# EAGLE design M121 (EAGLE 6.6.0)
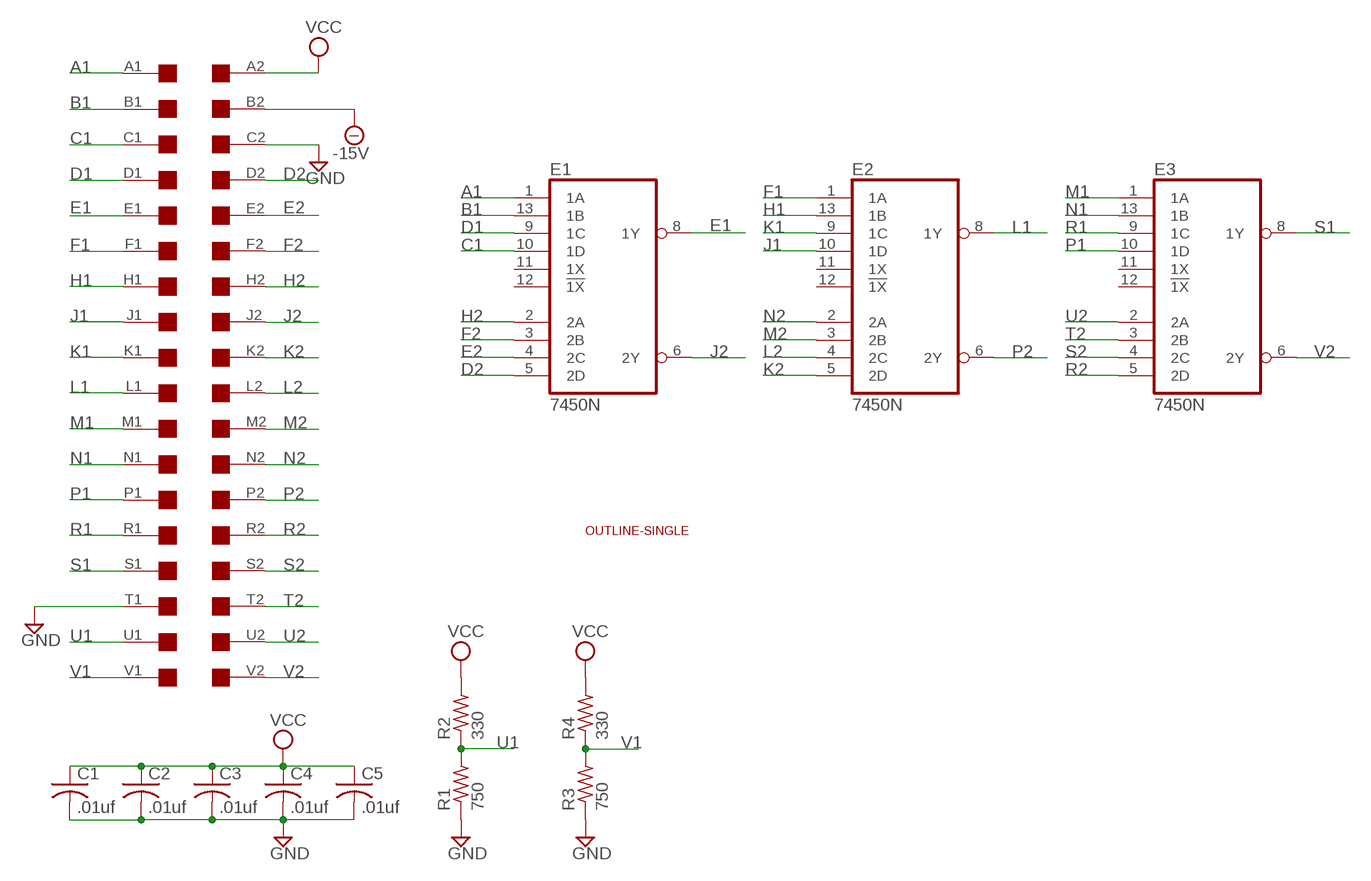
[diagram p0: schematic, sheet 1]

## Parts
C1  .01uf  C-US050-025X075  [C050-025X075]
C2  .01uf  C-US050-025X075  [C050-025X075]
C3  .01uf  C-US050-025X075  [C050-025X075]
C4  .01uf  C-US050-025X075  [C050-025X075]
C5  .01uf  C-US050-025X075  [C050-025X075]
E1  7450N  [DIL14]
E2  7450N  [DIL14]
E3  7450N  [DIL14]
R1  750  R-US_0207/10  [0207/10]
R2  330  R-US_0207/10  [0207/10]
R3  750  R-US_0207/10  [0207/10]
R4  330  R-US_0207/10  [0207/10]
U$1  OUTLINE-SINGLE  [SINGLE]
U$4  SINGLE  [EDGE-CON2]

## Nets
-15V: U$4.B2
A1: E1.1(1A) U$4.A1
B1: E1.13(1B) U$4.B1
C1: E1.10(1D) U$4.C1
D1: E1.9(1C) U$4.D1
D2: E1.5(2D) U$4.D2
E1: E1.8(1Y) U$4.E1
E2: E1.4(2C) U$4.E2
F1: E2.1(1A) U$4.F1
F2: E1.3(2B) U$4.F2
GND: C1.2 C2.2 C3.2 C4.2 C5.2 R1.1 R3.1 U$4.C2 U$4.T1
H1: E2.13(1B) U$4.H1
H2: E1.2(2A) U$4.H2
J1: E2.10(1D) U$4.J1
J2: E1.6(2Y) U$4.J2
K1: E2.9(1C) U$4.K1
K2: E2.5(2D) U$4.K2
L1: E2.8(1Y) U$4.L1
L2: E2.4(2C) U$4.L2
M1: E3.1(1A) U$4.M1
M2: E2.3(2B) U$4.M2
N1: E3.13(1B) U$4.N1
N2: E2.2(2A) U$4.N2
P1: E3.10(1D) U$4.P1
P2: E2.6(2Y) U$4.P2
R1: E3.9(1C) U$4.R1
R2: E3.5(2D) U$4.R2
S1: E3.8(1Y) U$4.S1
S2: E3.4(2C) U$4.S2
T2: E3.3(2B) U$4.T2
U1: R1.2 R2.1 U$4.U1
U2: E3.2(2A) U$4.U2
V1: R3.2 R4.1 U$4.V1
V2: E3.6(2Y) U$4.V2
VCC: C1.1 C2.1 C3.1 C4.1 C5.1 R2.2 R4.2 U$4.A2
Unconnected: E1.11(1X) E1.12(!1X) E2.11(1X) E2.12(!1X) E3.11(1X) E3.12(!1X)

## Power pins joined to a net without a drawn wire
GND: E1.7(GND) E2.7(GND) E3.7(GND)
VCC: E1.14(VCC) E2.14(VCC) E3.14(VCC)

## Library data of the parts
C1-C5 = rcl:C-US: CAPACITOR, American symbol
E1-E3 = dec-con:74*50: Dual 2-wide 2-input AND OR INVERTER gate (one gate expandable)
R1-R4 = rcl:R-US_: RESISTOR, American symbol
U$1 = dec-con:OUTLINE-*: Board outlines for DEC boards.
U$4 = dec-con:SINGLE: Single-Height DEC board

## Board
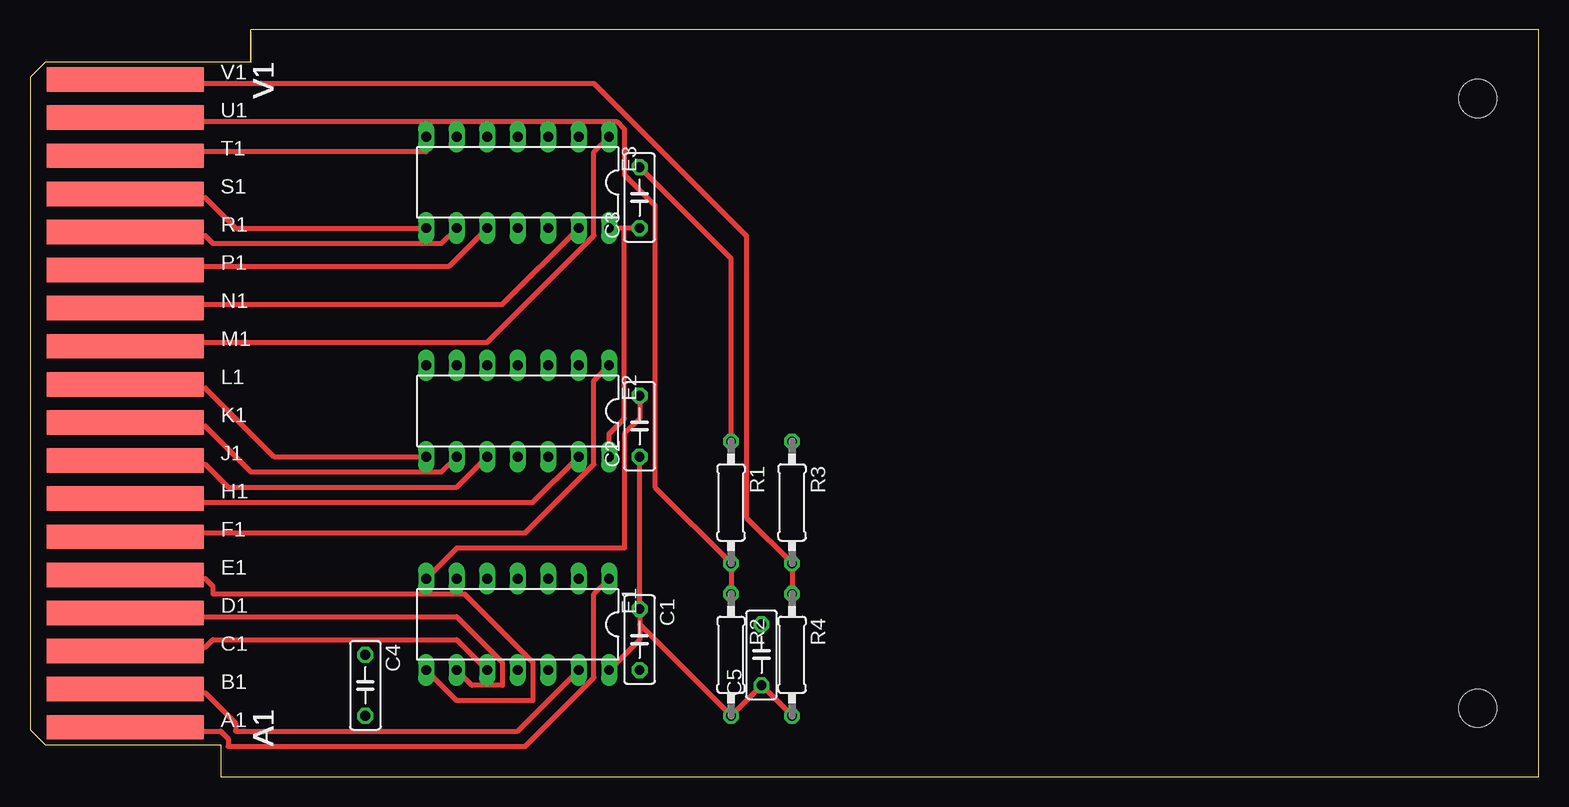
[diagram p1: board, top side]
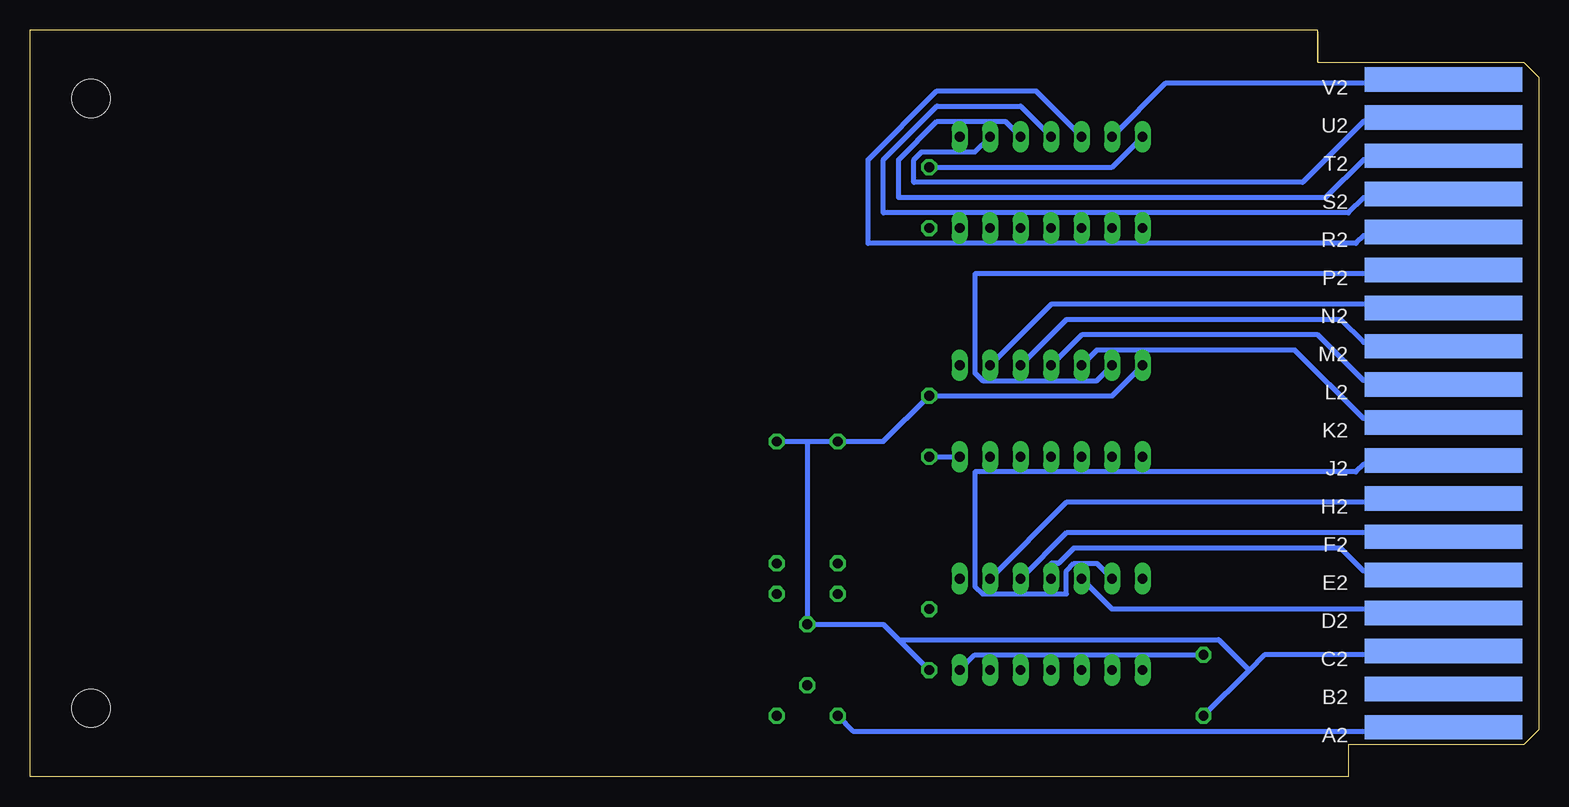
[diagram p2: board, bottom side, seen from below]

Size 125.73 x 62.23 mm. Coordinates in mm from the lower left corner, seen from the top.
Copper layers (1+16): Top 0.035mm / dielectric 1.5mm / Bottom 0.035mm
Design rules "16mils": minimum track width 16mil, minimum drill 32mil, track to track 15mil, track to pad 10mil, pad to pad 10mil, via to via 10mil, smd to smd 10mil, copper to edge 13mil, drill to drill 10mil, minimum pad ring 10mil, minimum via ring 8mil, stop-mask expansion 0mil, vias tented up to drill 0mil, thermal gap 10mil

### Footprints (pad centres in the part's own frame; a part is rotated, then mirrored left to right if it is on the bottom)
C050-025X075 = drill 0.813 octagon: 1 -2.54,0; 2 2.54,0
DIL14 = drill 0.813 long: 1 -7.62,-3.81; 2 -5.08,-3.81; 3 -2.54,-3.81; 4 0,-3.81; 5 2.54,-3.81; 6 5.08,-3.81; 7 7.62,-3.81; 8 7.62,3.81; 9 5.08,3.81; 10 2.54,3.81; 11 0,3.81; 12 -2.54,3.81; 13 -5.08,3.81; 14 -7.62,3.81
0207/10 = drill 0.813 octagon: 1 -5.08,0; 2 5.08,0
SINGLE = hole 3.175: 120.65,56.515; 120.65,5.715
EDGE-CON2 = smd 13.106 x 2.032: A1 7.938,4.128; B1 7.938,7.303; C1 7.938,10.477; D1 7.938,13.652; E1 7.938,16.828; F1 7.938,20.003; H1 7.938,23.177; J1 7.938,26.352; K1 7.938,29.527; L1 7.938,32.703; M1 7.938,35.877; N1 7.938,39.053; P1 7.938,42.227; R1 7.938,45.403; S1 7.938,48.578; T1 7.938,51.752; U1 7.938,54.928; V1 7.938,58.102 | smd 13.106 x 2.032 bottom: A2 7.938,4.128; B2 7.938,7.303; C2 7.938,10.477; D2 7.938,13.652; E2 7.938,16.828; F2 7.938,20.003; H2 7.938,23.177; J2 7.938,26.352; K2 7.938,29.527; L2 7.938,32.703; M2 7.938,35.877; N2 7.938,39.053; P2 7.938,42.227; R2 7.938,45.403; S2 7.938,48.578; T2 7.938,51.752; U2 7.938,54.928; V2 7.938,58.102

### Placement (x,y rotation side)
C1  50.8,11.43 270 top
C2  50.8,29.21 90 top
C3  50.8,48.26 90 top
C4  27.94,7.62 270 top
C5  60.96,10.16 90 top
E1  40.64,12.7 180 top
E2  40.64,30.48 180 top
E3  40.64,49.53 180 top
R1  58.42,22.86 270 top
R2  58.42,10.16 270 top
R3  63.5,22.86 270 top
R4  63.5,10.16 270 top
U$1  0,0 0 top
U$4  0,0 0 top

### Tracks (layer width: path | path; a pad name or v marks a point on that pad's centre or on a via)
A1
  Top 0.406: E1.1 46.99,15.24 46.99,8.26 41.28,2.54 16.51,2.54 16.51,3.17 15.88,3.81 8.26,3.81 U$4.A1
B1
  Top 0.406: E1.13 40.64,3.81 17.15,3.81 17.15,4.45 14.61,6.99 8.26,6.99 U$4.B1
C1
  Top 0.406: E1.10 35.56,11.43 15.24,11.43 14.61,10.79 8.26,10.79 U$4.C1
D1
  Top 0.406: E1.9 36.83,7.62 39.37,7.62 39.37,9.53 35.56,13.34 8.26,13.34 U$4.D1
D2
  Bottom 0.406: E1.5 35.56,13.97 8.26,13.97 U$4.D2
E1
  Top 0.406: E1.8 35.56,6.35 41.91,6.35 41.91,9.53 36.2,15.24 15.24,15.24 15.24,15.88 14.61,16.51 8.26,16.51 U$4.E1
E2
  Bottom 0.406: E1.4 40.64,17.78 40.01,17.78 38.74,19.05 16.51,19.05 14.61,17.14 8.26,17.14 U$4.E2
F1
  Top 0.406: E2.1 46.99,33.02 46.99,26.04 41.28,20.32 8.26,20.32 U$4.F1
F2
  Bottom 0.406: E1.3 39.37,20.32 8.26,20.32 U$4.F2
GND
  Top 0.406: E1.7 35.56,19.05 49.53,19.05 49.53,28.57 50.8,29.84 C2.2 | C3.2 58.42,43.18 R1.1 | E3.7 33.02,52.07 8.26,52.07 U$4.T1
  Bottom 0.406: 24.13,8.89 22.86,10.16 8.26,10.16 U$4.C2 | 24.13,8.89 C4.2 | E2.7 35.56,31.75 C2.2 54.61,27.94 R1.1 60.96,27.94 | 53.34,11.43 54.61,12.7 C5.2 60.96,27.94 | 53.34,11.43 C1.2 | R3.1 60.96,27.94 | E3.7 35.56,50.8 C3.2 | 24.13,8.89 26.67,11.43 53.34,11.43
H1
  Top 0.406: E2.13 41.91,22.86 8.26,22.86 U$4.H1
H2
  Bottom 0.406: E1.2 39.37,22.86 8.26,22.86 U$4.H2
J1
  Top 0.406: E2.10 35.56,24.13 16.51,24.13 14.61,26.04 8.26,26.04 U$4.J1
J2
  Bottom 0.406: E1.6 36.83,17.78 38.74,17.78 39.37,17.14 39.37,15.24 46.36,15.24 46.99,15.88 46.99,25.4 15.24,25.4 14.61,26.04 8.26,26.04 U$4.J2
K1
  Top 0.406: E2.9 34.29,25.4 18.42,25.4 14.61,29.21 8.26,29.21 U$4.K1
K2
  Bottom 0.406: E2.5 36.83,35.56 20.32,35.56 14.61,29.84 8.26,29.84 U$4.K2
L1
  Top 0.406: E2.8 20.32,26.67 14.61,32.38 8.26,32.38 U$4.L1
L2
  Bottom 0.406: E2.4 38.1,36.83 18.42,36.83 14.61,33.02 8.26,33.02 U$4.L2
M1
  Top 0.406: E3.1 46.99,52.07 46.99,45.09 38.1,36.2 8.26,36.2 U$4.M1
M2
  Bottom 0.406: E2.3 39.37,38.1 16.51,38.1 14.61,36.2 8.26,36.2 U$4.M2
N1
  Top 0.406: E3.13 39.37,39.37 8.26,39.37 U$4.N1
N2
  Bottom 0.406: E2.2 40.64,39.37 8.26,39.37 U$4.N2
P1
  Top 0.406: E3.10 34.93,42.55 8.26,42.55 U$4.P1
P2
  Bottom 0.406: E2.6 36.83,33.02 46.36,33.02 46.99,33.66 46.99,41.91 8.26,41.91 U$4.P2
R1
  Top 0.406: E3.9 34.29,44.45 15.24,44.45 14.61,45.09 8.26,45.09 U$4.R1
R2
  Bottom 0.406: E3.5 41.91,57.15 50.17,57.15 55.88,51.44 55.88,44.45 15.24,44.45 14.61,45.09 8.26,45.09 U$4.R2
S1
  Top 0.406: E3.8 17.15,45.72 14.61,48.26 8.26,48.26 U$4.S1
S2
  Bottom 0.406: E3.4 43.18,55.88 50.17,55.88 54.61,51.44 54.61,46.99 15.88,46.99 14.61,48.26 8.26,48.26 U$4.S2
T2
  Bottom 0.406: E3.3 44.45,54.61 50.17,54.61 53.34,51.44 53.34,48.26 17.78,48.26 14.61,51.44 8.26,51.44 U$4.T2
U1
  Top 0.406: R2.1 R1.2 52.07,24.13 52.07,47.62 49.53,50.16 49.53,53.98 48.9,54.61 8.26,54.61 U$4.U1
U2
  Bottom 0.406: E3.2 46.99,52.07 51.44,52.07 52.07,51.44 52.07,49.53 19.69,49.53 14.61,54.61 8.26,54.61 U$4.U2
V1
  Top 0.406: R4.1 R3.2 59.69,21.59 59.69,45.09 46.99,57.78 8.26,57.78 U$4.V1
V2
  Bottom 0.406: E3.6 31.12,57.78 8.26,57.78 U$4.V2
VCC
  Top 0.406: R4.2 C5.1 R2.2 50.8,12.7 | C3.1 49.53,45.72 | 49.53,45.72 E3.14 | E1.14 50.8,11.43 50.8,12.7 | 50.8,12.7 C1.1 C2.1 | 49.53,45.72 49.53,29.84 48.26,28.57 E2.14
  Bottom 0.406: C2.1 E2.14 | C4.1 46.99,10.16 E1.14 | R2.2 57.15,3.81 8.26,3.81 U$4.A2

### Text on the board
tNames: V1 | V1 | V1 | V1 | V1 | V1 | V1 | V1 | V1 | V1 | V1 | V1 | V1 | V1 | V1 | V1 | V1 | V1 | V1 | V1 | V1 | V1 | V1 | V1 | V1 | V1 | V1 | V1 | V1 | V1 | V1 | V1 | A1 | A1 | A1 | A1 | A1 | A1 | A1 | A1 | A1 | A1 | A1 | A1 | A1 | A1 | A1 | A1 | A1 | A1 | A1 | A1 | A1 | A1 | A1 | A1 | A1 | A1 | A1 | A1 | A1 | A1 | A1 | A1